# Altium schematic sheet SH06 - OMAP-L137 USB2.SchDoc
size 386 x 246 mm
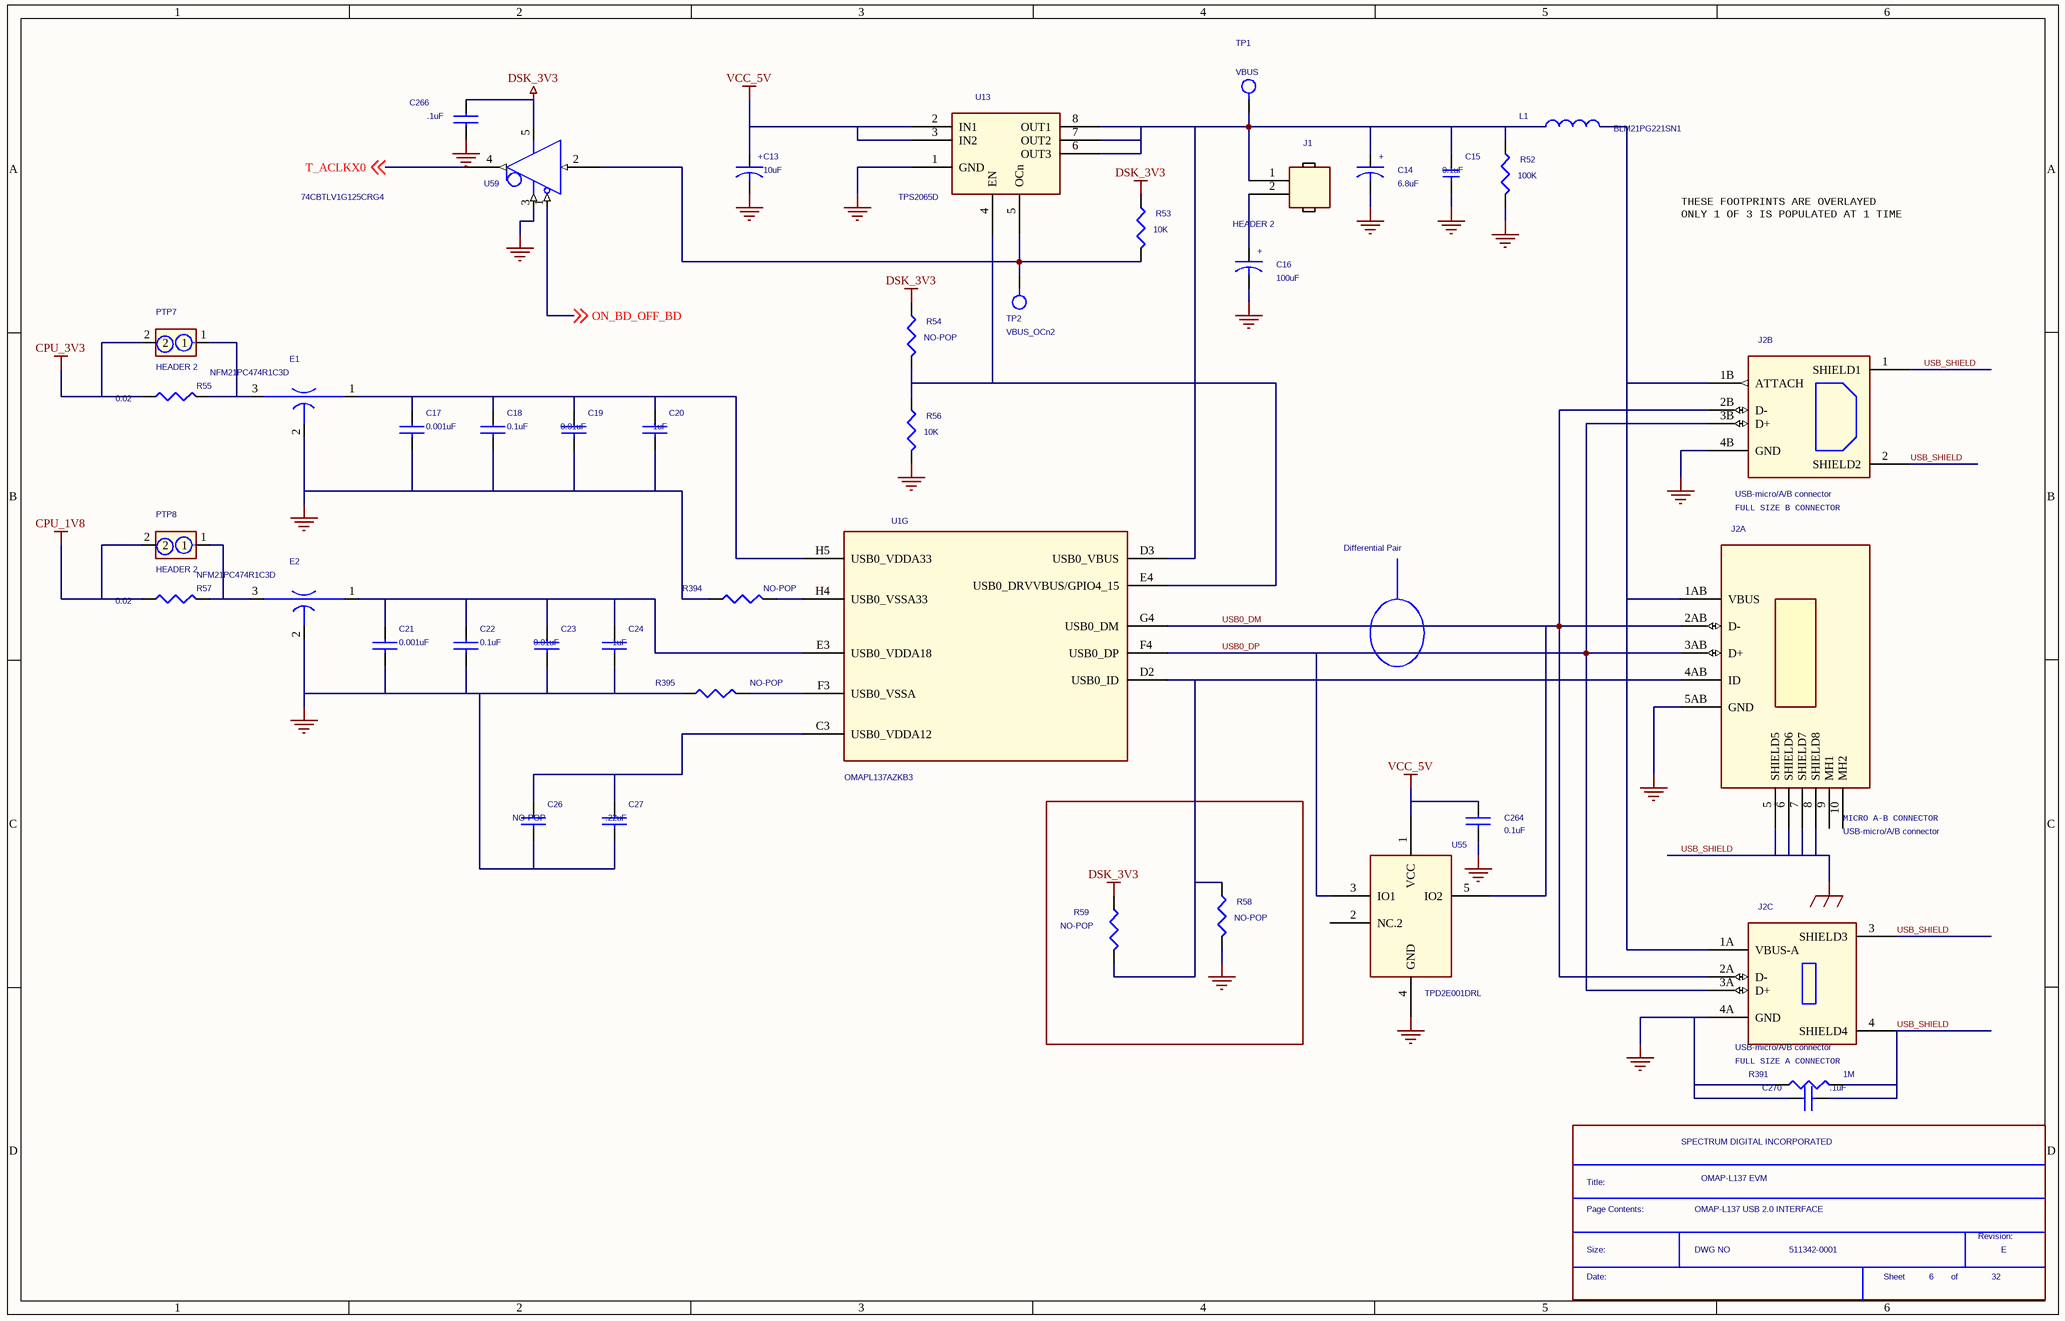
[diagram p0: SH06 - OMAP-L137 USB2.SchDoc]

## Parts
*  Page Contents:: OMAP-L137 USB 2.0 INTERFACE  RevCode: E  Title: OMAP-L137 EVM  OrgName: SPECTRUM DIGITAL INCORPORATED  Doc: 511342-0001  Page Number: 6  Page Count: 32  (hidden comment: SDTitleBlock)  (graphical)
C13  10uF  [EIA-A]
C14  6.8uF  [EIA-A]
C15  0.1uF  [0603]
C16  100uF  [EIA-A]
C17  0.001uF  [c402-25]
C18  0.1uF  [c402-25]
C19  0.01uF  [c402-25]
C20  1uF  [c603-35x45]
C21  0.001uF  [c402-25]
C22  0.1uF  [c402-25]
C23  0.01uF  [c402-25]
C24  1uF  [c603-35x45]
C26  NO-POP  [c402-25]
C27  .22uF  [c603-35x45]
C264  0.1uF  [c402-25]
C266  .1uF  [c402-25]
C270  .1uF  [C0603]
E1  NFM21PC474R1C3D  [emi-NFM21p]
E2  NFM21PC474R1C3D  [emi-NFM21p]
J1  HEADER 2  [JUMP1X2-6040]
J2  USB-micro/A/B connector  [usb_tripl-rev2]  (parts A,B,C of 3)
L1  BLM21PG221SN1  [l805-35x60]
PTP7  HEADER 2  [JUMP1X2-6040]
PTP8  HEADER 2  [JUMP1X2-6040]
R52  100K  [r402-25]
R53  10K  [r402-25]
R54  NO-POP  [r402-25]
R55  0.02  [r1206-40x70]
R56  10K  [r402-25]
R57  0.02  [r1206-40x70]
R58  NO-POP  [r402-25]
R59  NO-POP  [r402-25]
R391  1M  [r603-35x45]
R394  NO-POP  [r402-25]
R395  NO-POP  [r402-25]
TP1  VBUS  [tp1-6040]
TP2  VBUS_OCn2  [tp1-6040]
U1  OMAPL137AZKB3  [skt256-6064]  (part G of 9)
U13  TPS2065D  [so8-25x75]
U55  TPD2E001DRL  [drl5-12x40]
U59  74CBTLV1G125CRG4  [DCK]

## Nets
CPU_1V8: PTP8.2 R57.2
CPU_3V3: PTP7.2 R55.2
DSK_3V3: C266.1 R53.1 R54.1 R59.1 U59.5(VCC)
GND: C13.2 C14.2 C15.2 C16.2 C17.2 C18.2 C19.2 C20.2 C21.2 C22.2 C23.2 C24.2 C26.2 C27.2 C264.2 C266.2 C270.1 E1.2 E2.2 J2.4A(GND) J2.4B(GND) J2.5AB(GND) R52.2 R56.2 R58.2 R391.1 R394.1 R395.1 U13.1(GND) U55.4(GND) U59.3(GND)
USB_SHIELD: C270.2 J2.1(SHIELD1) J2.2(SHIELD2) J2.3(SHIELD3) J2.4(SHIELD4) J2.5(SHIELD5) J2.6(SHIELD6) J2.7(SHIELD7) J2.8(SHIELD8) R391.2  [also labelled GND_EARTH]
VCC_5V: C13.1 C264.1 U13.2(IN1) U13.3(IN2) U55.1(VCC)
ON_BD_OFF_BD: U59.1(OE) ; off-sheet ON_BD_OFF_BD
T_ACLKX0: U59.4(O) ; off-sheet T_ACLKX0
USB0_DM: J2.2A(D-) J2.2AB(D-) J2.2B(D-) U1.G4(USB0_DM) U55.5(IO2)
USB0_DP: J2.3A(D+) J2.3AB(D+) J2.3B(D+) U1.F4(USB0_DP) U55.3(IO1)
NetC14_1: C14.1 C15.1 J1.1 L1.2 R52.1 TP1.1(PIN) U1.D3(USB0_VBUS) U13.6(OUT3) U13.7(OUT2) U13.8(OUT1)
NetC16_1: C16.1 J1.2
NetC17_1: C17.1 C18.1 C19.1 C20.1 E1.1 U1.H5(USB0_VDDA33)
NetC21_1: C21.1 C22.1 C23.1 C24.1 E2.1 U1.E3(USB0_VDDA18)
NetC26_1: C26.1 C27.1 U1.C3(USB0_VDDA12)
NetE1_3: E1.3 PTP7.1 R55.1
NetE2_3: E2.3 PTP8.1 R57.1
NetJ2_1A: J2.1A(VBUS-A) J2.1AB(VBUS) J2.1B(ATTACH) L1.1
NetJ2_4AB: J2.4AB(ID) R58.1 R59.2 U1.D2(USB0_ID)
NetR53_2: R53.2 TP2.1(PIN) U13.5(OCn) U59.2(I)
NetR54_2: R54.2 R56.1 U1.E4(USB0_DRVVBUS/GPIO4_15) U13.4(EN)
NetR394_2: R394.2 U1.H4(USB0_VSSA33)
NetR395_2: R395.2 U1.F3(USB0_VSSA)

Not connected (* = marked no-connect by the designer): J2 9(MH1) 10(MH2); U55 2(NC.2)

## Notes on the sheet
- THESE FOOTPRINTS ARE OVERLAYED
  ONLY 1 OF 3 IS POPULATED AT 1 TIME
- (near J2) FULL SIZE B CONNECTOR
- Differential Pair
- (near J2) MICRO A-B CONNECTOR
- FULL SIZE A CONNECTOR
- (in symbol Cap 4_1.7uF Tan 10V 20% EIA_A) +
- (in symbol SDTitleBlock) Title:; Page Contents:; Revision:; Size:; DWG NO; Date:; Sheet; of

## Library data of the parts
C13 = Cap 4_1.7uF Tan 10V 20% EIA_A: 4.7uF Capacitor, Tantalum, 10V, 20%; NCPartnumber: EIA_A; Mfr: Panasonic; PartName: Cap 4.7uF Tan 10V 20% EIA_A; MfrNum: ECS-T1AY475R; Part #: 101003-0101R; Cost10K: 0.257; Cost100: 0.418; Vendor: xxxx; VendorNum: PCS2475CT-ND; SD PCB Footprint: EIA1206
C14 = Cap 4_1.7uF Tan 10V 20% EIA_A: 4.7uF Capacitor, Tantalum, 10V, 20%; NCPartnumber: EIA_A; Mfr: Panasonic; PartName: Cap 4.7uF Tan 10V 20% EIA_A; MfrNum: ECS-T1AY475R; Part #: 102359-0680R; Cost10K: 0.257; Cost100: 0.418; Vendor: xxxx; VendorNum: PCS2475CT-ND; SD PCB Footprint: EIA1206
C15 = Cap 100nF Cermc 16V 10% 603: 0.1uF Capacitor, Ceramic, 16V, 10%, 0603; MfrNum: ECJ-1VB1C104K; Mfr: Panasonic; NCPartnumber: 1C0056; Part #: 101587-1100R; VendorNum: PCC1762CT-ND; Vendor: Digikey; Cost100: 0.0694; Cost10K: 0.038; TI Footprint: c603-35x45; SD PCB Footprint: EIA0402; PartName: Cap 100nF Cermc 16V 10% 603
C16 = Cap 4_1.7uF Tan 10V 20% EIA_A: 4.7uF Capacitor, Tantalum, 10V, 20%; NCPartnumber: EIA_A; Mfr: Panasonic; PartName: Cap 4.7uF Tan 10V 20% EIA_A; MfrNum: ECS-T1AY475R; Part #: 101608-0102R; Cost10K: 0.257; Cost100: 0.418; Vendor: xxxx; VendorNum: PCS2475CT-ND; SD PCB Footprint: EIA1206
C17 C21 = CAP NP: Part #: 102058-1102R
C18 C22 = CAP NP: Part #: 101587-1100R
C19 C23 = CAP NP: Part #: 101587-1101R
C20 C24 = CAP NP: Part #: 101007-0100R
C26 = CAP NP: Part #: C0402-NOPOP
C27 = CAP NP: Part #: 101005-1220R
C264 = CAP NP_0: Part #: 101587-1100R
C266 = CAP NP_2: Part #: 101587-1100R
C270 = CAP .1 uF 10% 0603: Part #: 101587-1100R
E1 E2 = NFM_1: Part #: 102569-1470R
J1 = HEADER 2: Part #: 100115-0002R
J2 = USBCONN3_0: Part #: 102836-0001R
L1 = INDUCTOR_3: Part #: 101228-2201R
PTP7 PTP8 = PTP2: Single Line Header 2pin Tin; NCPartnumber: 2H0000; MfrNum: PTC02SAAN; Mfr: Sullins; Cost10K: 0.252; Vendor: Digikey; Cost100: 0.252; PartName: HEADER2Pin
R52 = R: Part #: 101370-1004R
R53 R56 = R: Part #: 101370-1003R
R54 R58 R59 = R: Part #: R0402-NOPOP
R55 R57 = R: Part #: 102598-0002R
R391 = R: Part #: 100642-1005R
R394 R395 = R
TP1 = Test Point_1: TEST POINT 0.100; PartName: HEADER 1; MfrNum: PZC36DAAN; Mfr: Sullins; Part #: 100115-0001R; Vendor: Digikey; Vendor Nbr: S2111-36-ND; Cost10K: 0.018; Cost100: 0.031; VendorNum: S2011-36-ND; Assy_NO-POP: Do Not Populate; SD PCB Footprint: CON1; TI Footprint: tp1-6040; ION Footprint: tp1-6040
TP2 = Test Point_1: TEST POINT 0.100; PartName: HEADER 1; Part #: 100115-0001R; Mfr: Sullins; MfrNum: PZC36DAAN; Vendor: Digikey; Vendor Nbr: S2111-36-ND; SD PCB Footprint: CON1; Assy_NO-POP: Do Not Populate; VendorNum: S2011-36-ND; Cost100: 0.031; Cost10K: 0.018; ION Footprint: tp1-6040; TI Footprint: tp1-6040
U1 = PRIMUS_BGA_1: Part #: 102772-0001; SWAP_INFO: (S1+S2+S3+S4+S5+S6+S7+S8+S9); SPLIT_INST: TRUE
U13 = tps2061_1: Part #: 102810-0001R
U55 = TPDE0001RSE_0: Part #: 102728-0001R
U59 = SN74LVC1G125: Part #: 101689-0125R